# Altium schematic sheet Esquemático SensorTemperatura.SchDoc
size A4; SheetNumber: 1; SheetTotal: 1
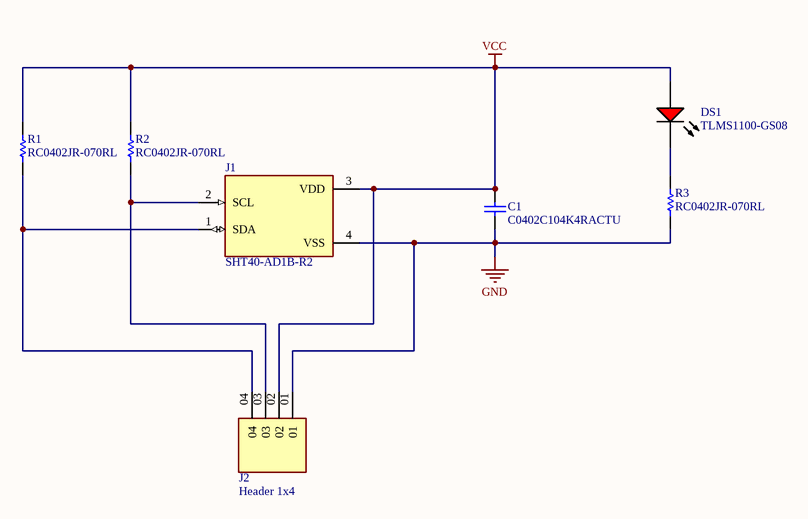
[diagram p0: Esquemático SensorTemperatura.SchDoc]

## Parts
C1  C0402C104K4RACTU  [Capacitor]
DS1  TLMS1100-GS08  [LED 0603]
J1  SHT40-AD1B-R2  [SHT40]
J2  Header 1x4  [Header 1x4]
R1  RC0402JR-070RL  [Resistor]
R2  RC0402JR-070RL  [Resistor]
R3  RC0402JR-070RL  [Resistor]

## Nets
GND: C1.1 J1.4(VSS) J2.01 R3.1
VCC: C1.2 DS1.1(A) J1.3(VDD) J2.02 R1.2 R2.2
NetDS1_2: DS1.2(K) R3.2
NetJ1_1: J1.1(SDA) J2.04 R1.1
NetJ1_2: J1.2(SCL) J2.03 R2.1

## Library data of the parts
C1 = Capacitor: Manufacturer: Kemet; Part Number: C0402C104K4RACTU
DS1 = LED 0603: LED, RED, 2.1 V, -40 to 100 degC, 2-Pin SMD (0603), RoHS, Tape and Reel; Type (Capacitors): C0G; Resistance: 100000000000 Ohm; Capacitance: 12 pF; Voltage Rating: 50 V; Tolerance: 5%; Min Operating Temperature: -55degC; REACH SVHC: No SVHC; ComponentLink2Description: Datasheet; ComponentLink1URL: http://www.vishay.com/; Width: 0.8 mm; Package Quantity: 4000; PackageReference: TLMX1100; ComponentLink2URL: http://www.vishay.com/docs/83173/tlmb1100.pdf; Case/Package: 0603; Case Code (Metric): 1608; Packaging: Tape and Reel; Pins: 2; ComponentLink1Description: Manufacturer URL; Max Operating Temperature: 125degC; Height: 0.8 mm; Length: 1.6 mm; Mount: Surface Mount; PackageDescription: 2-Pin Surface Mount Device, Body 1.6 x 0.8 mm; DatasheetVersion: Rev. 2.7, 03/2016; Case Code (Imperial): 0603; Voltage Rating (DC): 50 V; RoHSCompliant: True; Radiation Hardening: No
J1 = SHT40-AD1B-R2: Humidity/Temperature Sensor Digital Serial (I2C) 4-Pin DFN EP T/R; MF: Sensirion AG; Package: None; Value: *; Purchase-URL: https://pricing.snapeda.com/search/part/SHT40-AD1B-R2/?ref=eda; Availability: In Stock; MP: SHT40-AD1B-R2; Check_prices: https://www.snapeda.com/parts/SHT40-AD1B-R2/NSI/view-part/?ref=eda; SnapEDA_Link: https://www.snapeda.com/parts/SHT40-AD1B-R2/NSI/view-part/?ref=snap; Price: None
J2 = Header 1x4: <a href="https://pricing.snapeda.com/parts/TSW-104-07-G-S/Samtec/view-part?ref=eda">Check availability</a>; MP: altium_native_batch; Package: None; Price: None; Value: *; Availability: Unavailable
R1-R3 = Resistor: Manufacturer: Yageo / Phycomp; Part Number: RC0402JR-070RL